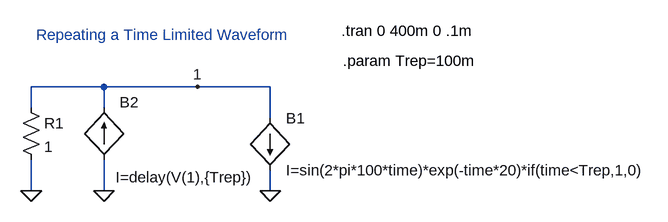
[diagram p0: schematic repeated_wave.asc]
repeated_wave.asc, the LTspice schematic file:
Version 4
SHEET 1 1892 680
WIRE 512 288 512 256
WIRE 512 416 512 368
WIRE 624 256 512 256
WIRE 624 288 624 256
WIRE 624 416 624 368
WIRE 768 256 624 256
WIRE 880 256 768 256
WIRE 880 304 880 256
WIRE 880 416 880 384
FLAG 624 416 0
FLAG 880 416 0
FLAG 768 256 1
FLAG 512 416 0
SYMBOL bi 624 368 M180
WINDOW 0 24 88 Left 0
WINDOW 3 18 -27 Left 0
SYMATTR InstName B2
SYMATTR Value I=delay(V(1),{Trep})
SYMBOL bi 880 304 R0
SYMATTR InstName B1
SYMATTR Value I=sin(2*pi*100*time)*exp(-time*20)*if(time<Trep,1,0)
SYMBOL res 496 272 R0
SYMATTR InstName R1
SYMATTR Value 1
TEXT 990 170 Left 0 !.tran 0 400m 0 .1m
TEXT 992 216 Left 0 !.param Trep=100m
TEXT 520 176 Left 0 ;Repeating a Time Limited Waveform

The netlist it stands for:
* repeated_wave.asc
B2 0 1 I=delay(V(1),{Trep})
B1 1 0 I=sin(2*pi*100*time)*exp(-time*20)*if(time<Trep,1,0)
R1 1 0 1
.tran 0 400m 0 .1m
.param Trep=100m
* Repeating a Time Limited Waveform
.backanno
.end